# EAGLE design RobotnikCytronController (EAGLE 6.6.0)
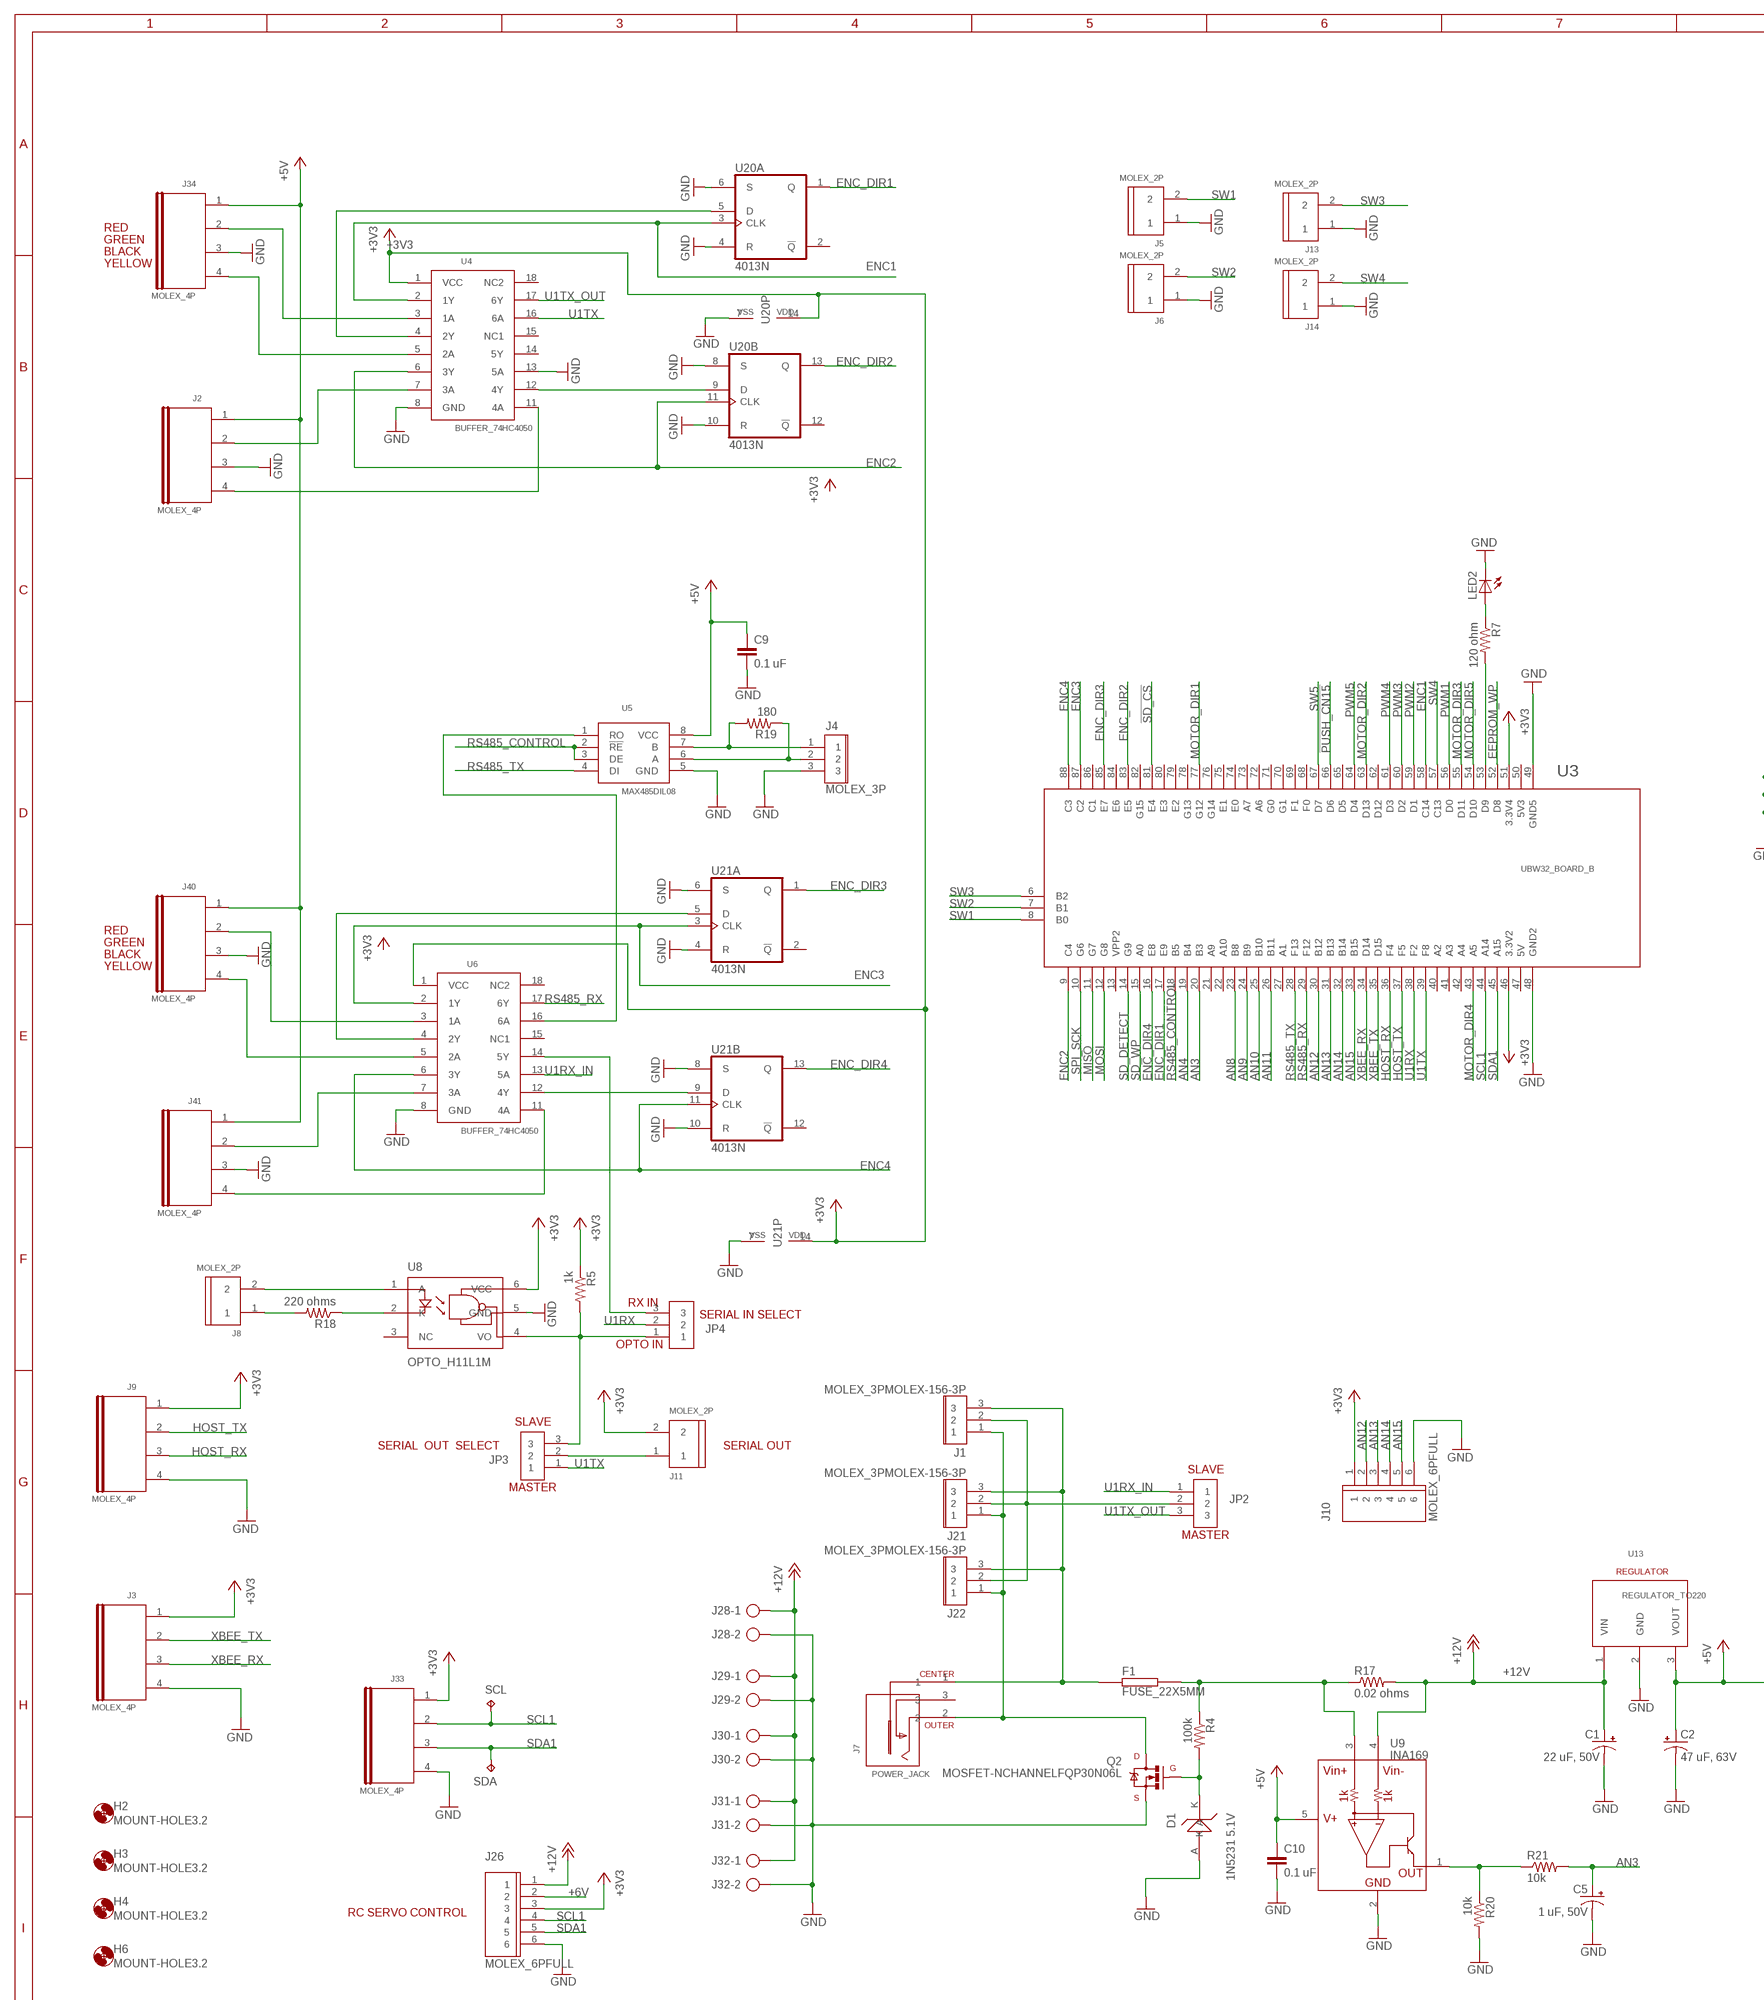
[diagram p0: schematic, sheet 1, part 1 of 2]
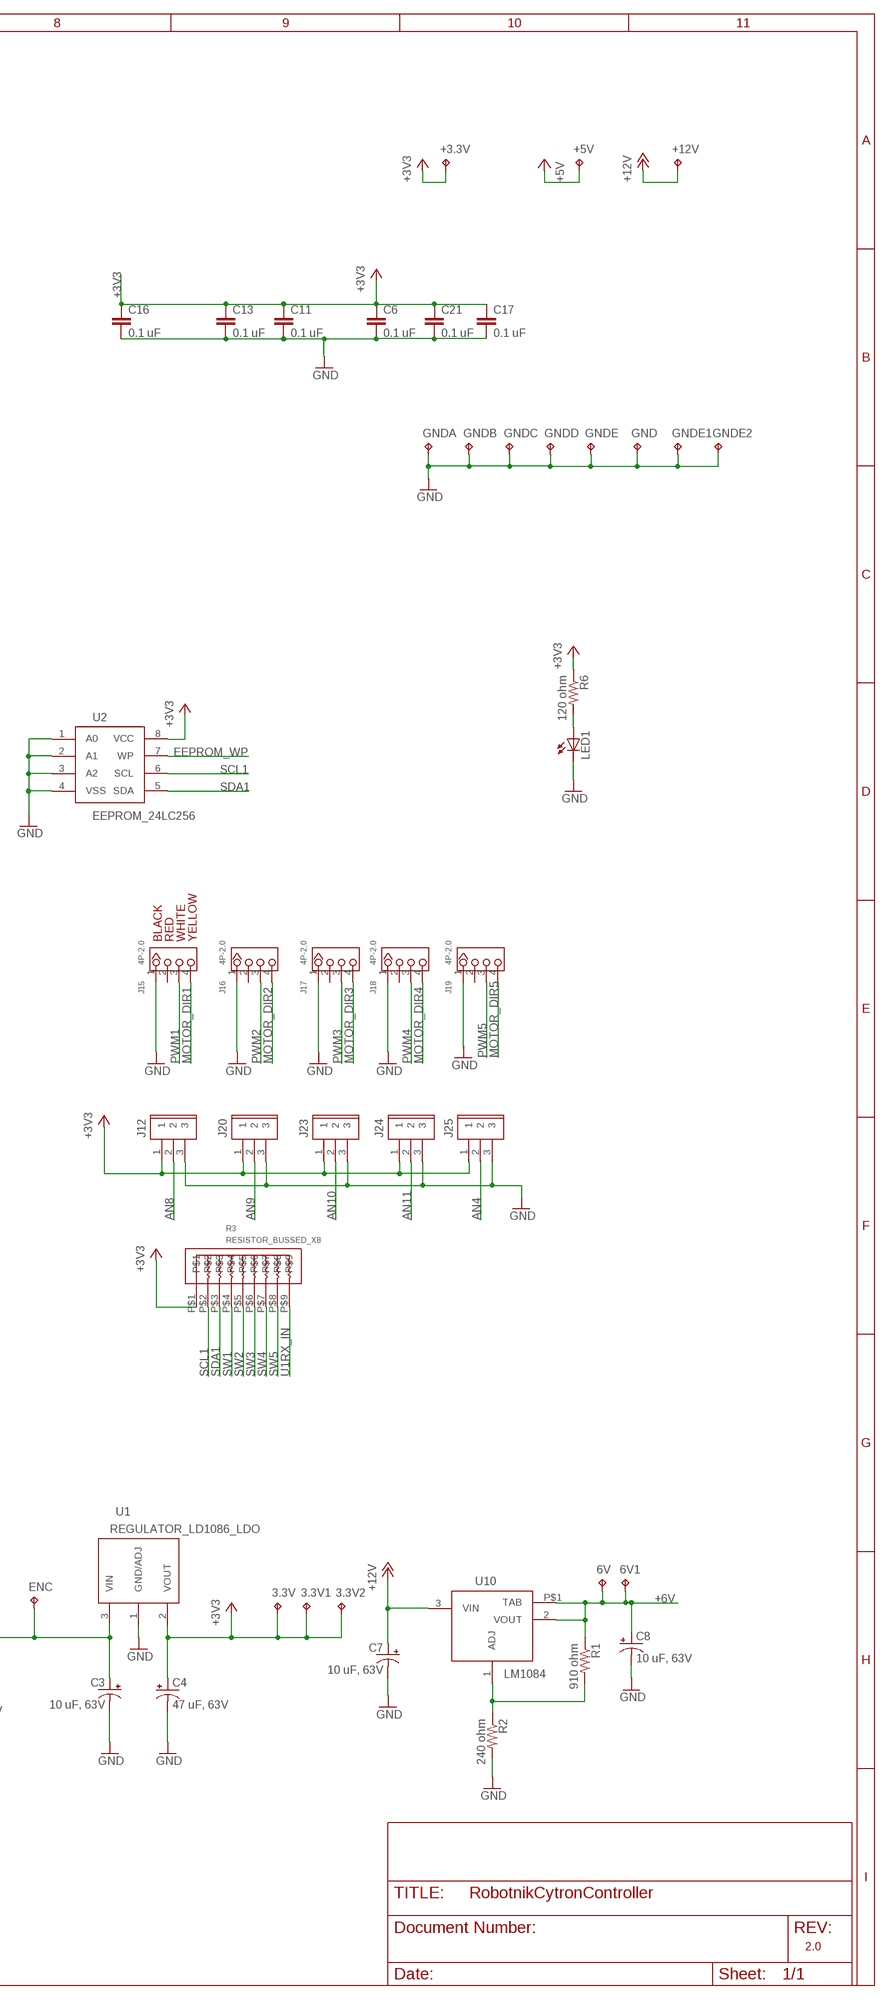
[diagram p1: schematic, sheet 1, part 2 of 2]

## Parts
3.3V  TPPAD1-13  [P1-13]
3.3V1  TPPAD1-13  [P1-13]
3.3V2  TPPAD1-13  [P1-13]
6V  TPPAD1-13  [P1-13]
6V1  TPPAD1-13  [P1-13]
+3.3V  TPPAD1-13  [P1-13]
+5V  TPPAD1-13  [P1-13]
+12V  TPPAD1-13  [P1-13]
C1  22 uF, 50V  POLCAPE2-5  [POLCAP_2MM]
C2  47 uF, 63V  POLCAPE2-5  [POLCAP_2MM]
C3  10 uF, 63V  POLCAPE2-5  [POLCAP_2MM]
C4  47 uF, 63V  POLCAPE2-5  [POLCAP_2MM]
C5  1 uF, 50V  POLCAPE2-5  [POLCAP_2MM]
C6  0.1 uF  C5/2.5  [C5B2.5]
C7  10 uF, 63V  POLCAPE2-5  [POLCAP_2MM]
C8  10 uF, 63V  POLCAPE2-5  [POLCAP_2MM]
C9  0.1 uF  C5/2.5  [C5B2.5]
C10  0.1 uF  C5/2.5  [C5B2.5]
C11  0.1 uF  C5/2.5  [C5B2.5]
C13  0.1 uF  C5/2.5  [C5B2.5]
C16  0.1 uF  C5/2.5  [C5B2.5]
C17  0.1 uF  C5/2.5  [C5B2.5]
C21  0.1 uF  C5/2.5  [C5B2.5]
D1  1N5231 5.1V  DIODE-ZENER  [T-18_THRU]
ENC  TPPAD1-13  [P1-13]
F1  FUSE_22X5MM  [SH22,5]
GND  TPPAD1-13  [P1-13]
GNDA  TPPAD1-13  [P1-13]
GNDB  TPPAD1-13  [P1-13]
GNDC  TPPAD1-13  [P1-13]
GNDD  TPPAD1-13  [P1-13]
GNDE  TPPAD1-13  [P1-13]
GNDE1  TPPAD1-13  [P1-13]
GNDE2  TPPAD1-13  [P1-13]
H2  MOUNT-HOLE3.2  [3,2]
H3  MOUNT-HOLE3.2  [3,2]
H4  MOUNT-HOLE3.2  [3,2]
H6  MOUNT-HOLE3.2  [3,2]
J1  MOLEX_3PMOLEX-156-3P  [MOLEX-156-3]
J2  MOLEX_4P  [MOLEX_4P_SLIM]
J3  MOLEX_4P  [MOLEX_4P_SLIM]
J4  MOLEX_3P  [MOLEX_3P]
J5  MOLEX_2P  [MOLEX_2P]
J6  MOLEX_2P  [MOLEX_2P]
J7  POWER_JACK  [POWER_JACK_PJ-202A]
J8  MOLEX_2P  [MOLEX_2P]
J9  MOLEX_4P  [MOLEX_4P_SLIM]
J10  MOLEX_6PFULL  [MOLEX_6P]
J11  MOLEX_2P  [MOLEX_2P]
J12  MOLEX_3P  [MOLEX_3P]
J13  MOLEX_2P  [MOLEX_2P]
J14  MOLEX_2P  [MOLEX_2P]
J15  4P-2.0  GROVE-CONNECTOR-DIP(4P-2.0)  [HW4-2.0]
J16  4P-2.0  GROVE-CONNECTOR-DIP(4P-2.0)  [HW4-2.0]
J17  4P-2.0  GROVE-CONNECTOR-DIP(4P-2.0)  [HW4-2.0]
J18  4P-2.0  GROVE-CONNECTOR-DIP(4P-2.0)  [HW4-2.0]
J19  4P-2.0  GROVE-CONNECTOR-DIP(4P-2.0)  [HW4-2.0]
J20  MOLEX_3P  [MOLEX_3P]
J21  MOLEX_3PMOLEX-156-3P  [MOLEX-156-3]
J22  MOLEX_3PMOLEX-156-3P  [MOLEX-156-3]
J23  MOLEX_3P  [MOLEX_3P]
J24  MOLEX_3P  [MOLEX_3P]
J25  MOLEX_3P  [MOLEX_3P]
J26  MOLEX_6PFULL  [MOLEX_6P]
J28  TRMBLOCK_5MM_2P  [TRMBLOCK_5MM_2P]
J29  TRMBLOCK_5MM_2P  [TRMBLOCK_5MM_2P]
J30  TRMBLOCK_5MM_2P  [TRMBLOCK_5MM_2P]
J31  TRMBLOCK_5MM_2P  [TRMBLOCK_5MM_2P]
J32  TRMBLOCK_5MM_2P  [TRMBLOCK_5MM_2P]
J33  MOLEX_4P  [MOLEX_4P_SLIM]
J34  MOLEX_4P  [MOLEX_4P_SLIM]
J40  MOLEX_4P  [MOLEX_4P_SLIM]
J41  MOLEX_4P  [MOLEX_4P_SLIM]
JP2  JUMPER_3P  [JUMPER_3P_MINI]
JP3  JUMPER_3P  [JUMPER_3P_MINI]
JP4  JUMPER_3P  [JUMPER_3P_MINI]
LED1  LED5MM  [LED5MM]
LED2  LED5MM  [LED5MM]
Q2  MOSFET-NCHANNELFQP30N06L  [TO220V]
R1  910 ohm  RESISTOR0207/12  [1/4_WATT]
R2  240 ohm  RESISTOR0207/12  [1/4_WATT]
R3  RESISTOR_BUSSED_X8  [RESISTOR_BUSSED]
R4  100k  RESISTOR0207/12  [1/4_WATT]
R5  1k  RESISTOR0207/12  [1/4_WATT]
R6  120 ohm  RESISTOR0207/12  [1/4_WATT]
R7  120 ohm  RESISTOR0207/12  [1/4_WATT]
R17  0.02 ohms  RESISTOR_CURRENT_SENSE0309/12  [CURRENT_SENSE]
R18  220 ohms  RESISTOR0207/12  [1/4_WATT]
R19  180  RESISTOR0207/12  [1/4_WATT]
R20  10k  RESISTOR0207/12  [1/4_WATT]
R21  10k  RESISTOR0207/12  [1/4_WATT]
SCL  TPPAD1-13  [P1-13]
SDA  TPPAD1-13  [P1-13]
U1  REGULATOR_LD1086_LDO  [D2PAK]
U2  EEPROM_24LC256  [DIL08]
U3  UBW32_BOARD_B  [UBW32_B]
U4  BUFFER_74HC4050  [DIL18]
U5  MAX485DIL08  [DIL08]
U6  BUFFER_74HC4050  [DIL18]
U8  OPTO_H11L1M  [DIP_6P]
U9  INA169  [SOT23-5]
U10  LM1084  [TO220_HEATSINK]
U13  REGULATOR_TO220  [TO220V]
U20  4013N  [DIL14]
U21  4013N  [DIL14]

## Nets
!PUSH_CN15: U3.66(D6)
!SD_CS: U3.81(E4)
+3V3: 3.3V1.TP 3.3V2.TP 3.3V.TP +3.3V.TP C4.+ C6.1 C11.1 C13.1 C16.1 C17.1 C21.1 J3.1 J9.1 J10.1 J11.2 J12.1 J20.1 J23.1 J24.1 J25.1 J26.3 J33.1 R3.P$1 R5.1 R6.1 U1.2(VOUT) U2.8(VCC) U3.46(3.3V2) U3.51(3.3V4) U4.1(VCC) U6.1(VCC) U8.6(VCC) U20.14(P:VDD) U21.14(P:VDD)
+5V: +5V.TP C2.+ C3.+ C9.1 C10.1 ENC.TP J2.1 J34.1 J40.1 J41.1 U1.3(VIN) U5.8(VCC) U9.5(V+) U13.3(VOUT)
+6V: 6V1.TP 6V.TP C8.+ J26.2 R1.1 U10.2(VOUT) U10.P$1(TAB)
+12V: +12V.TP C1.+ C7.+ J26.1 J28.1 J29.1 J30.1 J31.1 J32.1 R17.2 U9.4(VIN-) U10.3(VIN) U13.1(VIN)
AN3: C5.+ R21.2 U3.20(B3)
AN4: J25.2 U3.19(B4)
AN8: J12.2 U3.23(B8)
AN9: J20.2 U3.24(B9)
AN10: J23.2 U3.25(B10)
AN11: J24.2 U3.26(B11)
AN12: J10.2 U3.30(B12)
AN13: J10.3 U3.31(B13)
AN14: J10.4 U3.32(B14)
AN15: J10.5 U3.33(B15)
EEPROM_WP: U2.7(WP) U3.52(D8)
ENC1: U3.58(C14) U4.2(1Y) U20.3(A:CLK)
ENC2: U3.9(C4) U4.6(3Y) U20.11(B:CLK)
ENC3: U3.87(C2) U6.2(1Y) U21.3(A:CLK)
ENC4: U3.88(C3) U6.6(3Y) U21.11(B:CLK)
ENC_DIR1: U3.17(E9) U20.1(A:Q)
ENC_DIR2: U3.83(E5) U20.13(B:Q)
ENC_DIR3: U3.85(E7) U21.1(A:Q)
ENC_DIR4: U3.16(E8) U21.13(B:Q)
GND: C1.- C2.- C3.- C4.- C5.- C6.2 C7.- C8.- C9.2 C10.2 C11.2 C13.2 C16.2 C17.2 C21.2 D1.A GND.TP GNDA.TP GNDB.TP GNDC.TP GNDD.TP GNDE1.TP GNDE2.TP GNDE.TP J2.3 J3.4 J4.3 J5.1 J6.1 J9.4 J10.6 J12.3 J13.1 J14.1 J15.1 J16.1 J17.1 J18.1 J19.1 J20.3 J23.3 J24.3 J25.3 J26.6 J28.2 J29.2 J30.2 J31.2 J32.2 J33.4 J34.3 J40.3 J41.3 LED1.K(C) LED2.K(C) Q2.3(S) R2.2 R20.2 U1.1(GND/ADJ) U2.1(A0) U2.2(A1) U2.3(A2) U2.4(VSS) U3.48(GND2) U3.49(GND5) U4.8(GND) U4.13(5A) U5.5(GND) U6.8(GND) U8.5(GND) U9.2(GND) U13.2(GND) U20.4(A:R) U20.6(A:S) U20.7(P:VSS) U20.8(B:S) U20.10(B:R) U21.4(A:R) U21.6(A:S) U21.7(P:VSS) U21.8(B:S) U21.10(B:R)
HOST_RX: J9.3 U3.36(F4)
HOST_TX: J9.2 U3.37(F5)
MISO: U3.11(G7)
MOSI: U3.12(G8)
MOTOR_DIR1: J15.4 U3.77(G12)
MOTOR_DIR2: J16.4 U3.63(D13)
MOTOR_DIR3: J17.4 U3.55(D11)
MOTOR_DIR4: J18.4 U3.43(A5)
MOTOR_DIR5: J19.4 U3.54(D10)
N$1: D1.K Q2.1(G) R4.2
N$2: U4.12(4Y) U20.9(B:D)
N$3: LED1.A R6.2
N$4: J1.1 J7.2 J21.1 J22.1 Q2.2(D)
N$5: J11.1 JP3.2
N$6: JP4.3 U6.14(5Y)
N$7: J34.2 U4.3(1A)
N$8: U5.1(RO) U6.16(6A)
N$9: F1.1 J1.3 J7.1 J21.3 J22.3
N$10: U4.4(2Y) U20.5(A:D)
N$11: J34.4 U4.5(2A)
N$12: R7.2 U3.53(D9)
N$13: LED2.A R7.1
N$15: J2.2 U4.7(3A)
N$16: J2.4 U4.11(4A)
N$17: R1.2 R2.1 U10.1(ADJ)
N$19: J4.1 R19.2 U5.7(B)
N$20: J4.2 R19.1 U5.6(A)
N$22: J40.2 U6.3(1A)
N$23: J8.1 R18.2
N$24: U6.4(2Y) U21.5(A:D)
N$25: J40.4 U6.5(2A)
N$26: U6.12(4Y) U21.9(B:D)
N$27: R18.1 U8.2(K)
N$28: J41.2 U6.7(3A)
N$29: J41.4 U6.11(4A)
N$30: J1.2 J21.2 J22.2 JP2.2
N$32: J8.2 U8.1(A)
N$33: F1.2 R4.1 R17.1 U9.3(VIN+)
N$36: R20.1 R21.1 U9.1(OUT)
OPTO_IN: JP3.3 JP4.1 R5.2 U8.4(VO)
PWM1: J15.3 U3.56(D0)
PWM2: J16.3 U3.59(D1)
PWM3: J17.3 U3.60(D2)
PWM4: J18.3 U3.61(D3)
PWM5: J19.3 U3.64(D4)
RS485_CONTROL: U3.18(B5) U5.2(!RE) U5.3(DE)
RS485_RX: U3.29(F12)
RS485_TX: U3.28(F13) U5.4(DI)
SCL1: J26.4 J33.2 R3.P$2 SCL.TP U2.6(SCL) U3.44(A14)
SD_DETECT: U3.14(G9)
SD_WP: U3.15(A0)
SDA1: J26.5 J33.3 R3.P$3 SDA.TP U2.5(SDA) U3.45(A15)
SPI_SCK: U3.10(G6)
SW1: J5.2 R3.P$4 U3.8(B0)
SW2: J6.2 R3.P$5 U3.7(B1)
SW3: J13.2 R3.P$6 U3.6(B2)
SW4: J14.2 R3.P$7 U3.57(C13)
SW5: R3.P$8 U3.67(D7)
U1RX: JP4.2 U3.38(F2)
U1RX_IN: JP2.1 R3.P$9 U6.13(5A)
U1TX: JP3.1 U3.39(F8)
U1TX_OUT: JP2.3
XBEE_RX: J3.3 U3.34(D14)
XBEE_TX: J3.2 U3.35(D15)
Unconnected: J7.3 J15.2 J16.2 J17.2 J18.2 J19.2 U3.13(VPP2) U3.21(A9) U3.22(A10) U3.27(A1) U3.40(A2) U3.41(A3) U3.42(A4) U3.62(D12) U3.65(D5) U3.68(F0) U3.69(F1) U3.70(G1) U3.71(G0) U3.72(A6) U3.73(A7) U3.74(E0) U3.75(E1) U3.76(G14) U3.78(G13) U3.79(E2) U3.80(E3) U3.82(G15) U3.84(E6) U3.86(C1) U4.14(5Y) U4.15(NC1) U4.16(6A) U4.17(6Y) U4.18(NC2) U6.15(NC1) U6.17(6Y) U6.18(NC2) U8.3(NC) U20.2(A:!Q) U20.12(B:!Q) U21.2(A:!Q) U21.12(B:!Q)

## Notes on the sheet
- RED
- GREEN
- BLACK
- YELLOW
- RED
- GREEN
- BLACK
- YELLOW | BLACK | RED | WHITE | YELLOW
- RX IN
- SERIAL IN SELECT
- OPTO IN
- SLAVE
- SERIAL  OUT  SELECT | SERIAL OUT
- SLAVE
- MASTER
- MASTER
- D
- G
- S
- RC SERVO CONTROL
- 2.0

## Power pins joined to a net without a drawn wire
5V: U3.47(5V)
5V3: U3.50(5V3)

## Library data of the parts
3.3V 3.3V1 3.3V2 6V 6V1 +3.3V +5V +12V ENC GND GNDA GNDB GNDC GNDD GNDE GNDE1 GNDE2 SCL SDA = testpad:TP: Test pad
C1-C5 C7 C8 = JimLib:POLCAP: POLARIZED CAPACITOR, American symbol
C6 C9-C11 C13 C16 C17 C21 = capacitor-wima:C: CAPACITOR naming: grid - package width
D1 = JimLib:DIODE-ZENER
F1 = JimLib:FUSE_22X5MM: Through hole 22x5mm fuse holder
H2-H4 H6 = holes:MOUNT-HOLE: MOUNTING HOLE with drill center marker
J1 J4 J12 J20-J25 = JimLib:MOLEX_3P
J2 J3 J9 J33 J34 J40 J41 = JimLib:MOLEX_4P: .100" (2.54mm) Center Header - 3 Pin
J5 J6 J8 J11 J13 J14 = JimLib:MOLEX_2P
J7 = JimLib:POWER_JACK
J10 J26 = JimLib:MOLEX_6P: .100" (2.54mm) Center Header - 3 Pin
J15-J19 = Seeed-Connector -2016:GROVE-CONNECTOR-DIP(4P-2.0): 320110033
J28-J32 = JimLib:TRMBLOCK_5MM_2P: CONNECTOR
JP2-JP4 = JimLib:JUMPER_3P
LED1 LED2 = JimLib:LED: LED OSRAM: - CHIPLED LG R971, LG N971, LY N971, LG Q971, LY Q971, LO R971, LY R971 LH N974, LH R974 LS Q976, LO Q976, LY Q976 LO Q996 - Hyper CHIPLED LW Q18S LB Q993, LB Q99A, LB R99A - SideLED LS A670, LO A670, LY A670, LG A670, LP A670 LB A673, LV A673, LT A673, LW A673 LH A674 LY A675 LS A676, LA A676, LO A676, LY A676, LW A676 LS A679, LY A679, LG A679 - Hyper Micro SIDELED® LS Y876, LA Y876, LO Y876, LY Y876 LT Y87S - SmartLED LW L88C, LW L88S LB L89C, LB L89S, LG L890 LS L89K, LO L89K, LY L89K LS L896, LA L896, LO L896, LY L896 - TOPLED LS T670, LO T670, LY T670, LG T670, LP T670 LSG T670, LSP T670, LSY T670, LOP T670, LYG T670 LG T671, LOG T671, LSG T671 LB T673, LV T673, LT T673, LW T673 LH T674 LS T676, LA T676, LO T676, LY T676, LB T676, LH T676, LSB T676, LW T676 LB T67C, LV T67C, LT T67C, LS T67K, LO T67K, LY T67K, LW E67C LS E67B, LA E67B, LO E67B, LY E67B, LB E67C, LV E67C, LT E67C LW T67C LS T679, LY T679, LG T679 LS T770, LO T770, LY T770, LG T770, LP T770 LB T773, LV T773, LT T773, LW T773 LH T774 LS E675, LA E675, LY E675, LS T675 LS T776, LA T776, LO T776, LY T776, LB T776 LHGB T686 LT T68C, LB T68C - Hyper Mini TOPLED® LB M676 - Mini TOPLED Santana® LG M470 LS M47K, LO M47K, LY M47K Source: http://www.osram.convergy.de LUXEON: - LUMILED® LXK2-PW12-R00, LXK2-PW12-S00, LXK2-PW14-U00, LXK2-PW14-V00 LXK2-PM12-R00, LXK2-PM12-S00, LXK2-PM14-U00 LXK2-PE12-Q00, LXK2-PE12-R00, LXK2-PE12-S00, LXK2-PE14-T00, LXK2-PE14-U00 LXK2-PB12-K00, LXK2-PB12-L00, LXK2-PB12-M00, LXK2-PB14-N00, LXK2-PB14-P00, LXK2-PB14-Q00 LXK2-PR12-L00, LXK2-PR12-M00, LXK2-PR14-Q00, LXK2-PR14-R00 LXK2-PD12-Q00, LXK2-PD12-R00, LXK2-PD12-S00 LXK2-PH12-R00, LXK2-PH12-S00 LXK2-PL12-P00, LXK2-PL12-Q00, LXK2-PL12-R00 Source: www.luxeon.com KINGBRIGHT: KA-3528ASYC Source: www.kingbright.com
Q2 = JimLib:MOSFET-NCHANNEL: Common NMOSFET Parts MFG P/N Store ID Prod ID FDD8780 TRANS-09984 SI7820DN TRANS-11055 FDS6630A IC-08089 2N7002PW TRANS-11151 FQP30N06L COM-10213 TRANS-10060 BSS123LT1G TRANS-08345 BSS138 TRANS-00830 BS170 2N7000; PROD_ID: TRANS-10060
R1 R2 R4-R7 R18-R21 = JimLib:RESISTOR: RESISTOR, American symbol
R3 = JimLib:RESISTOR_BUSSED_X8
R17 = JimLib:RESISTOR_CURRENT_SENSE: RESISTOR, American symbol
U1 = JimLib:REGULATOR_LD1086_LDO
U2 = JimLib:EEPROM_24LC256
U3 = JimLib:UBW32_BOARD_B: UBW32 - 32 bit PIC32 based USB Bit Whacker Version 2.6 Technical Specifications: PIC 32MX795F512L 8.0 Mhz Crystal VCC: 7.6-15V
U4 U6 = JimLib:BUFFER_74HC4050: Non-Inverting Hex Buffer 2V-6V supply
U5 = JimLib:MAX485
U8 = JimLib:OPTO_H11L1M
U9 = JimLib:INA169
U10 = JimLib:LM1084
U13 = JimLib:REGULATOR_TO220
U20 U21 = JimLib:4013: Dual D FLIP FLOP, set/reset

## Board
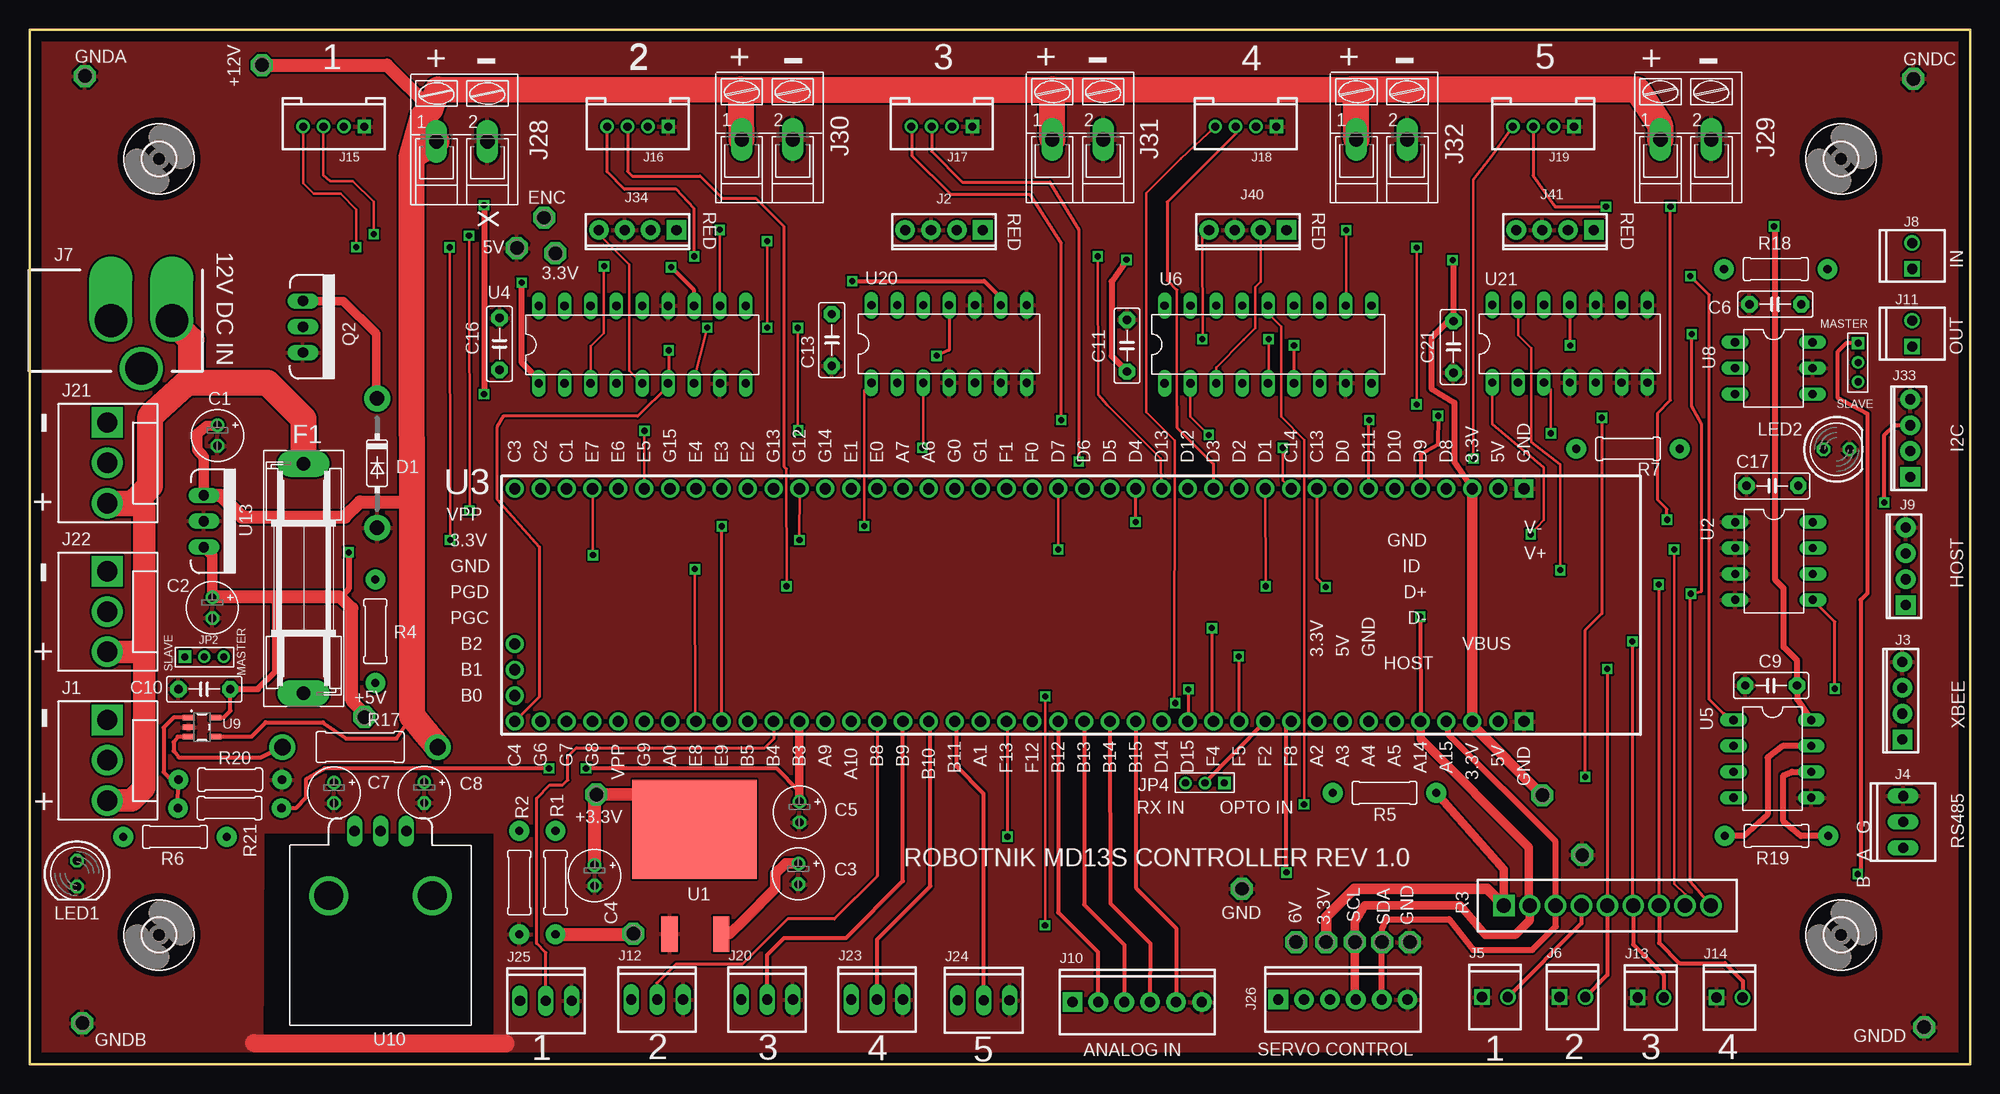
[diagram p2: board, top side]
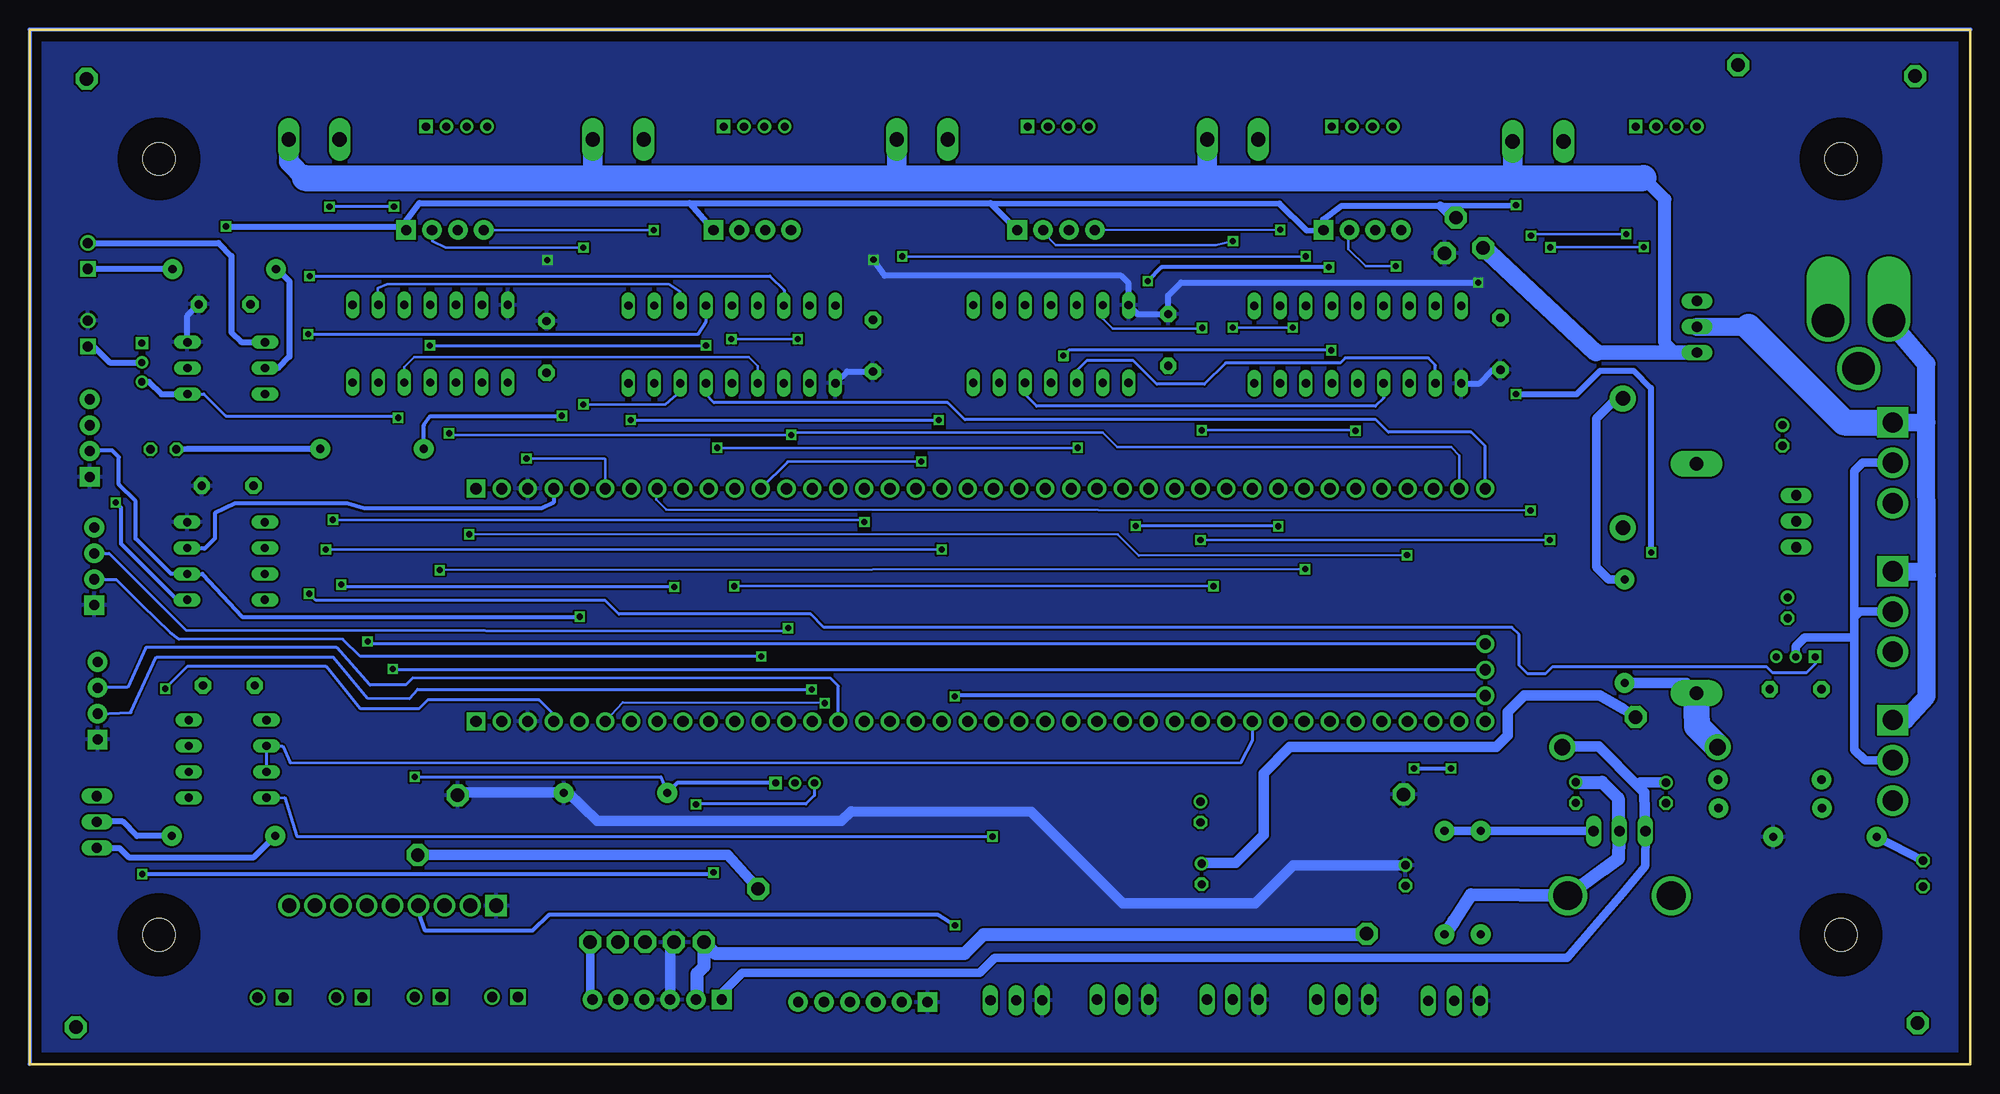
[diagram p3: board, bottom side, seen from below]

Size 190.5 x 101.6 mm. Coordinates in mm from the lower left corner, seen from the top.
Outline: 0,0 190.5,0 190.5,101.6 0,101.6 0,0
Copper layers (1*16): Top 0.035mm / dielectric 1.5mm / Bottom 0.035mm
Design rules "default *": minimum track width 10mil, minimum drill 19mil, track to track 8mil, track to pad 8mil, pad to pad 8mil, via to via 8mil, smd to smd 8mil, copper to edge 40mil, drill to drill 8mil, minimum pad ring 10mil, minimum via ring 8mil, stop-mask expansion 4mil, vias tented up to drill 0mil, thermal gap 10mil

### Footprints (pad centres in the part's own frame; a part is rotated, then mirrored left to right if it is on the bottom)
P1-13 = drill 1.321 pad 2.159 octagon: TP 0,0
POLCAP_2MM = drill 0.813 pad 1.27: + -1.016,0 | drill 0.813 pad 1.27 octagon: - 1.016,0
C5B2.5 = drill 0.813 pad 1.6 octagon: 1 -2.54,0; 2 2.54,0
T-18_THRU = drill 1.4 pad 2.54: A 6.35,0; K -6.35,0
SH22,5 = drill 1.321 pad 2.54 long: 1 -11.252,0; 2 11.252,0
3,2 = hole 3.2: 0,0
MOLEX-156-3 = drill 2 square: 1 -3.96,0 | drill 2: 2 0,0; 3 3.96,0
MOLEX_4P_SLIM = drill 1 pad 1.93 square: 1 -3.81,0 | drill 1 pad 1.93: 2 -1.27,0; 3 1.27,0; 4 3.81,0
MOLEX_3P = drill 1 long: 1 -2.54,0; 2 0,0; 3 2.54,0
MOLEX_2P = drill 1 square: 1 -1.27,0 | drill 1: 2 1.27,0
POWER_JACK_PJ-202A = drill 3.2 offset: 1 0,0; 2 0,6 | drill 3.2: 3 -4.7,3
MOLEX_6P = drill 1 pad 1.93 square: 1 -3.81,0 | drill 1 pad 1.93: 2 -1.27,0; 3 1.27,0; 4 3.81,0; 5 6.35,0; 6 8.89,0
HW4-2.0 = drill 0.8 pad 1.27 square: 1 -3,0 | drill 0.8 pad 1.27: 2 -1,0; 3 1,0; 4 3,0
TRMBLOCK_5MM_2P = drill 1.4 long: 1 -1.854,-1.27; 2 3.15,-1.27
JUMPER_3P_MINI = drill 0.7 square: 1 -1.905,0 | drill 0.7: 2 0,0; 3 1.905,0
LED5MM = drill 0.813 octagon: A -1.27,0; K 1.27,0
TO220V = drill 1.016 long: 1 -2.54,0; 2 0,0; 3 2.54,0
1/4_WATT = drill 0.813 pad 1.93: 1 -5.08,0; 2 5.08,0
RESISTOR_BUSSED = drill 1.4 square: P$1 0,0 | drill 1.4: P$2 2.54,0; P$3 5.08,0; P$4 7.62,0; P$5 10.16,0; P$6 12.7,0; P$7 15.24,0; P$8 17.78,0; P$9 20.32,0
CURRENT_SENSE = drill 1.6 pad 2.54: 1 -7.62,0; 2 7.62,0
D2PAK = smd 1.6 x 3.5: 1 -2.54,-10.275; 3 2.54,-10.275 | smd 12.2 x 9.75: 2 -0.1,0
DIL08 = drill 0.813 long: 1 -3.81,-3.81; 2 -1.27,-3.81; 3 1.27,-3.81; 4 3.81,-3.81; 5 3.81,3.81; 6 1.27,3.81; 7 -1.27,3.81; 8 -3.81,3.81
UBW32_B = drill 1.1 pad 1.778: 6 -49.53,-3.81; 7 -49.53,-6.35; 8 -49.53,-8.89; 9 -49.53,-11.43; 10 -46.99,-11.43; 11 -44.45,-11.43; 12 -41.91,-11.43; 13 -39.37,-11.43; 14 -36.83,-11.43; 15 -34.29,-11.43; 16 -31.75,-11.43; 17 -29.21,-11.43; 18 -26.67,-11.43; 19 -24.13,-11.43; 20 -21.59,-11.43; 21 -19.05,-11.43; 22 -16.51,-11.43; 23 -13.97,-11.43; 24 -11.43,-11.43; 25 -8.89,-11.43; 26 -6.35,-11.43; 27 -3.81,-11.43; 28 -1.27,-11.43; 29 1.27,-11.43; 30 3.81,-11.43; 31 6.35,-11.43; 32 8.89,-11.43; 33 11.43,-11.43; 34 13.97,-11.43; 35 16.51,-11.43; 36 19.05,-11.43; 37 21.59,-11.43; 38 24.13,-11.43; 39 26.67,-11.43; 40 29.21,-11.43; 41 31.75,-11.43; 42 34.29,-11.43; 43 36.83,-11.43; 44 39.37,-11.43; 45 41.91,-11.43; 46 44.45,-11.43; 47 46.99,-11.43; 50 46.99,11.43; 51 44.45,11.43; 52 41.91,11.43; 53 39.37,11.43; 54 36.83,11.43; 55 34.29,11.43; 56 31.75,11.43; 57 29.21,11.43; 58 26.67,11.43; 59 24.13,11.43; 60 21.59,11.43; 61 19.05,11.43; 62 16.51,11.43; 63 13.97,11.43; 64 11.43,11.43; 65 8.89,11.43; 66 6.35,11.43; 67 3.81,11.43; 68 1.27,11.43; 69 -1.27,11.43; 70 -3.81,11.43; 71 -6.35,11.43; 72 -8.89,11.43; 73 -11.43,11.43; 74 -13.97,11.43; 75 -16.51,11.43; 76 -19.05,11.43; 77 -21.59,11.43; 78 -24.13,11.43; 79 -26.67,11.43; 80 -29.21,11.43; 81 -31.75,11.43; 82 -34.29,11.43; 83 -36.83,11.43; 84 -39.37,11.43; 85 -41.91,11.43; 86 -44.45,11.43; 87 -46.99,11.43; 88 -49.53,11.43 | drill 1.1 pad 1.778 square: 48 49.53,-11.43; 49 49.53,11.43
DIL18 = drill 0.813 long: 1 -10.16,-3.81; 2 -7.62,-3.81; 3 -5.08,-3.81; 4 -2.54,-3.81; 5 0,-3.81; 6 2.54,-3.81; 7 5.08,-3.81; 8 7.62,-3.81; 9 10.16,-3.81; 10 10.16,3.81; 11 7.62,3.81; 12 5.08,3.81; 13 2.54,3.81; 14 0,3.81; 15 -2.54,3.81; 16 -5.08,3.81; 17 -7.62,3.81; 18 -10.16,3.81
DIP_6P = drill 0.813 long: 1 -3.81,-3.81; 2 -1.27,-3.81; 3 1.27,-3.81; 4 1.27,3.81; 5 -1.27,3.81; 6 -3.81,3.81
SOT23-5 = smd 0.55 x 1.2: 1 -0.95,-1.3; 2 0,-1.3; 3 0.95,-1.3; 4 0.95,1.3; 5 -0.95,1.3
TO220_HEATSINK = drill 1.016 long: 1 -2.54,0; 2 0,0; 3 2.54,0 | drill 2.8: P$1 -5.08,6.35; P$2 5.08,6.35
DIL14 = drill 0.813 long: 1 -7.62,-3.81; 2 -5.08,-3.81; 3 -2.54,-3.81; 4 0,-3.81; 5 2.54,-3.81; 6 5.08,-3.81; 7 7.62,-3.81; 8 7.62,3.81; 9 5.08,3.81; 10 2.54,3.81; 11 0,3.81; 12 -2.54,3.81; 13 -5.08,3.81; 14 -7.62,3.81

### Placement (x,y rotation side)
3.3V  127.25,11.99 0 top
3.3V1  148.49,26.42 0 top
3.3V2  51.61,79.63 0 top
6V  124.31,11.99 0 top
6V1  59.26,12.83 0 top
+3.3V  55.63,26.49 180 top
+5V  32.87,34.09 0 top
+12V  22.81,98.12 0 top
C1  18.43,61.74 270 top
C2  17.93,44.83 270 top
C3  75.45,18.69 270 top
C4  55.45,18.54 270 top
C5  75.56,24.77 270 top
C6  171.35,74.63 180 top
C7  29.87,26.64 270 top
C8  38.73,26.67 270 top
C9  170.94,37.19 180 top
C10  17.14,36.83 180 top
C11  107.72,70.56 90 top
C13  78.74,71.12 270 top
C16  46.13,70.74 90 top
C17  171.07,56.79 180 top
C21  139.75,70.43 270 top
D1  34.11,59.03 270 top
ENC  50.5,83.13 0 top
F1  26.9,47.7 270 top
GND  135.48,11.99 0 top
GNDA  5.44,97.03 0 top
GNDB  5.18,4.04 0 top
GNDC  184.91,96.77 0 top
GNDD  185.95,3.63 90 top
GNDE  47.83,80.16 0 top
GNDE1  152.4,20.55 0 top
GNDE2  119,17.22 0 top
H2  12.7,12.7 0 top
H3  177.8,12.7 0 top
H4  177.8,88.9 0 top
H6  12.7,88.9 0 top
J1  7.62,29.84 270 top
J2  89.75,81.92 180 top
J3  183.82,35.69 90 top
J4  183.9,23.79 90 top
J5  143.83,6.59 0 top
J6  151.44,6.59 0 top
J7  13.97,73.03 90 top
J8  184.78,79.38 90 top
J9  184.15,48.9 90 top
J10  106.17,6.1 0 top
J11  184.78,71.75 90 top
J12  61.59,6.35 0 top
J13  159.12,6.54 0 top
J14  166.85,6.54 0 top
J15  29.84,92.08 180 top
J16  59.69,92.08 180 top
J17  89.53,92.08 180 top
J18  119.38,92.08 180 top
J19  148.59,92.08 180 top
J20  72.39,6.35 0 top
J21  7.62,59.05 270 top
J22  7.62,44.45 270 top
J23  83.19,6.35 0 top
J24  93.65,6.27 0 top
J25  50.67,6.22 0 top
J26  126.36,6.35 0 top
J28  41.78,91.9 0 top
J29  161.93,92.08 0 top
J30  71.75,92.08 0 top
J31  102.23,92.08 0 top
J32  132.08,92.08 0 top
J33  184.6,61.48 90 top
J34  59.69,81.92 180 top
J40  119.57,81.92 180 top
J41  149.73,81.92 180 top
JP2  17.14,40.01 0 top
JP3  179.48,68.91 270 top
JP4  115.37,27.61 180 top
LED1  4.65,18.72 270 top
LED2  177.37,60.38 0 top
Q2  26.82,72.42 270 top
R1  51.61,17.83 90 top
R2  48.06,17.83 270 top
R3  144.71,15.57 0 top
R4  33.94,42.53 90 top
R5  132.99,26.64 180 top
R6  14.27,22.33 180 top
R7  156.9,60.43 180 top
R17  32.44,31.14 0 top
R18  171.4,78.08 0 top
R19  171.47,22.42 180 top
R20  19.68,27.94 0 top
R21  19.63,25.15 0 top
SCL  130.07,12.01 90 top
SDA  132.77,11.99 270 top
U1  65.36,23.06 0 top
U2  171.22,49.41 270 top
U3  97.16,45.09 0 top
U4  60.13,70.67 0 top
U5  171.07,29.98 270 top
U6  121.56,70.69 0 top
U8  171.2,67.08 270 top
U9  16.92,33.1 270 top
U10  34.44,22.89 180 top
U13  17.1,53.32 270 top
U20  90.25,70.73 0 top
U21  151.18,70.75 0 top

### Tracks (layer width: path | path; a pad name or v marks a point on that pad's centre or on a via)
+3V3  (via drill 0.6)
  Top 0.61: U4.1 49.98,67.22 48.31,68.89 48.31,76.71 48.51,76.73 v48.31,76.76 | v107.67,78.99 107.34,78.49 106.2,76.86 106.2,69.55 C11.1 | 139.27,72.97 137.59,71.3 137.59,66.37 139.85,64.97 139.85,59.13 U3.51 | v139.68,78.97 139.75,78.97 C21.1
  Top 0.813: R3.P$1 144.71,19.12 R5.1
  Top 1.016: U3.51 U3.46 141.6,33.3 3.3V1.TP | 3.3V.TP 127.25,14.45 130.02,17.22 143.06,17.22 R3.P$1
  Top 1.27: U1.2 61.77,26.54 +3.3V.TP 55.45,25.98 C4.+
  Bottom 0.61: v48.31,76.76 77.47,76.76 78.74,75.49 C13.1 81.75,73.66 U20.14 82.63,76.69 83.36,77.42 106.58,77.42 v107.67,78.99 107.64,78.97 | U6.1 110.26,68.02 C11.1 | U4.1 48.21,66.86 46.86,68.2 | U8.6 175.01,73.51 C6.1
  Bottom 0.813: 55.47,19.53 C4.+
  Bottom 1.016: R5.1 137.67,26.67 | 137.67,26.67 148.23,26.67 3.3V1.TP | 55.47,19.53 66.47,19.53 70.21,15.8 83.21,15.8 92.18,24.77 109.86,24.84 110.82,23.88 134.77,23.88 137.67,26.67 | J26.3 127.64,11.61 3.3V.TP
  pour Bottom: 0.03,0.08 22.89,0 35.05,0.08 44.15,0.03 45.69,0.03 190.45,0 190.47,101.5 0.05,101.55
+5V  (via drill 0.6)
  Top 0.406: U9.5 19.06,34.05 19.71,34.7 19.71,36.8 C10.1
  Top 0.61: C10.1 22.4,36.83 24.11,38.53 24.11,45.64 23.88,45.87 | v44.6,84.35 v44.6,65.81 | v31.32,50.27 31.32,46.69 30.5,45.87 | v171.22,82.27 171.35,82.14 171.35,47.55 172.16,46.74 172.16,40.97 173.48,39.65 C9.1 173.48,35.83 U5.8
  Top 1.016: C2.+ 17.93,49.95 U13.3 | U1.3 68.74,12.79 70.13,14.17 70.13,14.2 73.2,17.27 73.2,18.72 74.22,19.74 75.42,19.74 C3.+
  Top 1.27: +5V.TP 32.87,34.44 31.62,35.69 31.62,44.76 30.5,45.87 23.88,45.87 17.97,45.87 C2.+
  Bottom 0.61: 125.72,84.56 152.25,84.56 153.54,82.86 J41.1 153.9,82.27 v171.22,82.27 | 125.72,84.56 96.19,84.56 | 96.19,84.56 67.82,84.53 65.15,81.86 63.52,81.89 | 63.52,81.89 J34.1 | 96.19,84.56 96.19,84.55 J2.1 | 125.72,84.56 J40.1 | 63.52,81.89 63.52,82.96 61.72,84.3 52.05,84.3 v44.6,84.35 | v44.6,65.81 38.66,65.79 36.35,68.1 33.05,68.1 31.37,66.42 31.37,50.32 v31.32,50.27
  Bottom 0.813: ENC.TP 50.88,83.13 52.05,84.3
  Bottom 1.016: +5V.TP 34.09,34.9 36.37,36.2 43.79,36.2 45.39,34.59 45.39,32.31 46.56,31.14 66.8,31.14 69.37,28.57 69.37,22.53 72.11,19.79 75.37,19.79 C3.+
+6V
  Top 1.27: R1.1 59.18,12.75 6V1.TP
  Bottom 1.27: R1.1 50.72,14.05 49.02,16.64 U10.P$1 35.92,19.18 34.52,20.19 34.44,22.05 U10.2 34.57,22.15 34.57,26.11 36.14,27.69 C8.+ | J26.2 124.99,6.45 124.99,8.89 124.31,9.58 6V.TP 123.17,10.85 98.75,10.85 96.85,12.75 59.33,12.75 6V1.TP
+12V
  Top 0.406: 37.54,34.19 36.02,31.98 31.06,31.98 28.78,33.58 23.16,33.58 21.73,32.15 U9.4
  Top 1.016: 37.55,55.84 37.41,56.06 | U13.1 17.1,59.63 16.43,60.35 16.43,61.95 17.37,62.69 18.21,62.74 C1.+
  Top 1.27: 37.54,34.19 37.47,55.71 37.55,55.84 37.85,55.22 32.44,55.22 30.94,53.72 20.85,53.72 18.71,55.86 U13.1 | +12V.TP 35.08,98.12 39.37,93.83
  Top 2.54: 37.49,89.1 37.54,34.19 38.94,32.49 R17.2 | 37.49,89.1 J28.1 | 37.49,89.1 38.63,93.09 39.37,93.83 40.11,95.73 69.8,95.71 | 69.8,95.71 100.38,95.71 | 100.38,95.71 129.72,95.73 | 129.72,95.73 157.76,95.73 160.04,92.2 160.04,90.83 J29.1 | J32.1 130.23,94.41 129.72,95.73 | J31.1 100.38,95.71 | J30.1 69.8,95.71
  Bottom 0.813: J26.1 122.56,6.99 120.57,8.97 97.26,8.97 95.78,10.44 39.55,10.44 33.88,17.07 31.98,19.38 31.9,19.58 31.88,22.86 U10.3
  Bottom 1.016: U10.3 32,26.7 32.65,27.34 | 32.65,27.34 36.5,31.19 39.85,31.19 R17.2 | C7.+ 32.33,27.66 32.65,27.34
AN3  (via drill 0.6)
  Top 0.406: C5.+ 75.56,26.8 73.33,29.06 v54.61,29.06 | v50.98,29.06 28.96,29.06 27.13,27.96 27.13,26.16 26.11,25.15 R21.2
  Top 0.813: C5.+ U3.20
  Bottom 0.406: v54.61,29.06 v50.98,29.06
AN4
  Top 0.305: J25.2 50.67,10.95 49.76,11.86 49.76,26.11 51.05,27.41 52.32,27.41 52.83,27.91 52.83,30.23 53.67,31.06 72.16,31.06 73.08,31.98 73.08,33.6 U3.19
AN8
  Top 0.305: U3.23 83.19,18.47 78.99,14.28 74.4,14.28 69.95,9.83 63.42,9.83 61.54,7.95 61.54,6.4 J12.2
AN9
  Top 0.406: J20.2 72.39,10.72 74.07,12.39 80.14,12.39 85.72,17.98 U3.24
AN10
  Top 0.406: J23.2 83.19,12.24 88.42,17.48 88.42,33.5 U3.25
AN11
  Top 0.406: J24.2 93.65,26.57 90.98,29.23 90.98,33.48 U3.26
AN12
  Top 0.406: U3.30 100.97,14.91 104.85,11.02 104.85,6.15 J10.2
AN13
  Top 0.406: U3.31 103.5,15.67 107.47,11.71 107.47,6.12 J10.3
AN14
  Top 0.406: U3.32 106.1,15.77 110.01,11.86 109.96,6.12 J10.4
AN15
  Top 0.406: U3.33 108.58,17.32 112.55,13.36 112.55,6.78 113.08,6.25 112.67,6.25 J10.5
EEPROM_WP
  Bottom 0.406: U3.52 139.06,55.17 140.26,54.59 157.63,54.59 159.33,55.07 170.36,55.07 172.31,54.13 172.31,51.64 173.33,50.62 174.97,50.62 U2.7
ENC1  (via drill 0.6)
  Top 0.254: U20.3 87.71,60.61 v87.63,60.53 | v123.01,60.53 123.01,57.33 U3.58
  Bottom 0.254: v87.63,60.53 v123.01,60.53
  Bottom 0.305: U4.2 52.52,68.64 53.21,69.34 61.37,69.34 61.85,68.86 73.1,68.86 75.18,66.78 79.86,66.78 82.19,69.11 86.72,69.11 87.66,68.17 87.66,66.97 U20.3
ENC2  (via drill 0.6)
  Top 0.305: U3.9 50.04,36.07 50.04,50.8 45.87,55.52 45.87,62.56 46.48,63.63 59.69,63.63 62.67,66.61 U4.6 62.74,66.92 v62.74,70.1 | U20.11 90.25,70.13 v89.03,69.57
  Bottom 0.305: v62.74,70.1 88.49,70.1 v89.03,69.57
ENC3  (via drill 0.6)
  Top 0.254: U6.2 113.94,63.6 v115.75,61.8 | v149.33,61.95 149.33,66.25 U21.3
  Bottom 0.254: v149.33,61.95 149.17,61.8 v115.75,61.8 115.52,62.03 85.14,62.03 83.72,60.6 50.98,60.6 50.16,59.79 U3.87
ENC4  (via drill 0.6)
  Top 0.305: U21.11 151.18,71.05 v151.21,70.59 | v124.1,70.59 U6.6
  Bottom 0.305: v151.21,70.59 v124.1,70.59 | U3.88 47.62,60.71 49,62.08 57.12,62.08 58.34,63.3 98.7,63.3 100.38,64.97 123.34,64.97 124.16,65.79 124.16,66.83 U6.6
ENC_DIR1  (via drill 0.6)
  Top 0.254: v81.92,52.86 81.92,66.13 U20.1
  Top 0.305: U3.17 v67.94,52.83
  Bottom 0.305: v67.94,52.83 81.86,52.83 v81.92,52.86
ENC_DIR2  (via drill 0.6)
  Top 0.254: v75.41,72.31 75.41,62.28 v75.44,62.26 | v60.35,62.2 60.35,56.54 U3.83
  Bottom 0.254: U20.13 85.17,73.21 84.2,72.24 75.49,72.24 v75.41,72.31 | v75.44,62.26 60.4,62.26 v60.35,62.2
ENC_DIR3  (via drill 0.6)
  Top 0.254: U21.1 143.56,62.84 148.62,58.57 148.62,53.44 v147.34,52.05 | v55.3,49.99 55.3,56.46 U3.85
  Bottom 0.254: v147.34,52.05 83.69,52.02 81.64,49.96 v55.3,49.99
ENC_DIR4  (via drill 0.6)
  Top 0.254: U21.13 146.1,71.6 147.4,70.31 147.4,61.11 150.27,58.9 150.24,48.92 v150.24,48.51 | v65.3,48.62 65.35,33.71 U3.16
  Bottom 0.254: v150.24,48.51 v65.3,48.62
GND
  Top 1.778: 22.02,2.06 46.71,2.03
  Bottom 0.813: GND.TP 135.48,6.58 J26.6
  Bottom 1.016: GNDE.TP 47.3,79.73 | 26.85,69.9 Q2.3 | GNDE1.TP 121.97,20.57 GNDE2.TP
  Bottom 1.27: Q2.3 26.87,69.93 29.11,69.93 30,70.81 30,84.94 32.08,87.02
  Bottom 1.422: 36.75,69.9 26.85,69.9
  Bottom 1.778: 47.3,79.73 36.75,69.9
  Bottom 1.93: J28.2 44.93,87.12 44.83,87.02 | J30.2 74.91,87.12 75.01,87.02 | J31.2 105.39,87.25 105.16,87.02 | J32.2 135.23,87.4 135.61,87.02 | J29.2 165.07,88.62 163.47,87.02
  Bottom 2.54: 163.47,87.02 135.61,87.02 105.16,87.02 75.01,87.02 44.83,87.02 32.08,87.02
  pour Top: 0.03,0.08 22.81,0 22.86,22.86 45.72,22.86 45.72,0.05 190.47,0.1 190.55,101.55 0.08,101.57
HOST_RX  (via drill 0.6)
  Top 0.305: v116.05,42.82 116.05,33.81 U3.36
  Bottom 0.305: J9.3 182.7,50.16 175.16,42.62 116.33,42.55 v116.05,42.82
HOST_TX  (via drill 0.6)
  Top 0.305: U3.37 118.75,39.98 v118.69,40.03
  Bottom 0.305: v118.69,40.03 158.04,40.06 159.74,41.73 175.84,41.76 176.68,42.39 179.45,45.06 181.94,47.55 184.07,47.55 J9.2
MOTOR_DIR1  (via drill 0.6)
  Top 0.254: J15.4 26.84,86.52 27.89,85.47 30.53,85.47 32.08,83.92 32.08,80.77 v32.05,80.24 | v41.22,80.21 v41.27,51.49 | v75.56,51.49 75.59,56.49 U3.77
  Bottom 0.254: v32.05,80.24 40.66,80.21 v41.22,80.21 | v41.27,51.49 v75.56,51.49
MOTOR_DIR2  (via drill 0.6)
  Top 0.254: 65.23,79.38 v65.23,79.32 | v104.85,79.32 104.88,65.76 105.77,64.75 111.05,59.49 111.07,56.57 U3.63
  Top 0.305: 65.23,79.38 65.23,84.02 63.48,85.93 58.39,85.93 56.69,87.63 J16.4
  Bottom 0.254: v65.23,79.32 v104.85,79.32
MOTOR_DIR3  (via drill 0.6)
  Top 0.305: U3.55 131.44,63.2 v131.5,63.25 | v101.27,63.25 101.27,80.64 98.22,85.37 90.45,85.37 86.64,89.18 86.64,91.97 J17.4
  Bottom 0.305: v131.5,63.25 v101.27,63.25
MOTOR_DIR4  (via drill 0.6)
  Top 0.254: J18.4 113,88.9 109.63,85.52 109.6,64.06 112.39,61.27 112.37,35.69 v112.45,35.46
  Bottom 0.254: v112.45,35.46 132.26,35.51 U3.43
MOTOR_DIR5  (via drill 0.6)
  Top 0.254: J19.4 143.61,89.31 141.71,86.87 141.71,59.51 v141.73,59.49
  Bottom 0.254: v141.73,59.49 134.09,59.49 134.01,59.41 134.01,56.54 U3.54
N$1
  Top 0.813: Q2.1 30.81,74.95 34.01,71.75 34.01,65.48 D1.K
  Bottom 0.813: R4.2 35.49,47.61 36.7,48.82 36.7,63.4 34.75,65.35 34.13,65.35 D1.K
N$2  (via drill 0.6)
  Top 0.406: U4.12 65.22,76.01 v62.97,78.26 | v80.75,76.91 93.7,76.91 95.2,75.41 95.2,74.67 U20.9
  Bottom 0.406: v62.97,78.26 79.4,78.26 v80.75,76.91
N$3
  Bottom 0.813: R6.2 LED1.A
N$4
  Bottom 1.778: Q2.2 21.79,72.42 | J1.1 6.38,33.8 4.29,36.12 4.27,48.03 | 4.27,48.03 4.32,63.04 | 4.32,63.04 4.32,68.76 J7.2 | J21.1 4.55,63.04 4.32,63.04 | J22.1 4.62,48.38 4.27,48.03
  Bottom 2.54: 21.79,72.42 12.39,63.02 J21.1
N$5
  Bottom 0.61: J11.1 184.23,70.48 182.65,68.91 JP3.2
N$6  (via drill 0.6)
  Top 0.254: U6.14 121.56,73.71 122.83,72.44 122.83,63.6 125.09,61.32 v125.09,25.53
  Bottom 0.305: JP4.3 113.46,26.39 114.3,25.55 125.07,25.55 v125.09,25.53
N$7  (via drill 0.6)
  Top 0.254: U4.3 55.05,70.5 56.34,71.78 56.34,78.31 v56.39,78.36
  Bottom 0.254: v56.39,78.36 59.36,78.36 61.06,80.06 61.06,81.81 J34.2
N$8  (via drill 0.6)
  Top 0.305: U5.1 166.25,34.43 164.87,35.81 164.87,75.54 v163.02,77.39
  Bottom 0.305: v163.02,77.39 117.83,77.39 116.43,76 116.43,74.55 U6.16
N$9
  Top 2.184: J1.3 10.01,25.89 11.25,27.13 11.25,40.23 | 11.25,40.23 11.25,54.67 10.5,55.42 | J22.3 11,40.49 11.25,40.23
  Top 2.54: J21.3 10.16,55.07 10.5,55.42 11.84,56.82 11.86,63.63 15.73,67.17 | 15.73,67.17 15.88,67.31 15.88,71.12 J7.1 | F1.1 26.9,63.37 23.37,66.9 16,66.9 15.73,67.17
N$10
  Bottom 0.305: U4.4 57.59,65.42 58.4,64.62 91.64,64.62 92.76,65.73 92.76,66.89 U20.5
N$11
  Top 0.254: J34.4 55.88,81.53 58.88,78.54 58.88,68.11 U4.5
N$12  (via drill 0.6)
  Top 0.406: v138.25,63.68 138.23,60.83 136.53,59.92 U3.53
  Bottom 0.406: R7.2 151.79,62.76 151.16,63.63 138.23,63.63 v138.25,63.68
N$13
  Bottom 0.61: R7.1 175.01,60.43 LED2.A
N$14
  Bottom 0.406: 0,101.6 190.5,101.6 190.5,0
N$15  (via drill 0.6)
  Top 0.254: v72.39,80.82 v72.42,72.34 | v66.52,72.34 65.15,66.92 U4.7
  Bottom 0.254: J2.2 91.02,81.7 89.76,80.42 74.09,80.42 v72.39,80.82 | v72.42,72.34 v66.52,72.34
N$16  (via drill 0.6)
  Top 0.254: v67.74,81.94 U4.11
  Bottom 0.254: J2.4 v67.74,81.94
N$17
  Bottom 0.813: R1.2 R2.1 37.08,22.91 U10.1
N$19
  Top 0.61: U5.7 172.07,31.25 170.59,30.12 170.59,24.51 168.28,22.43 166.79,22.43 R19.2
  Bottom 0.61: J4.1 181.7,21.25 180.77,20.32 168.49,20.32 R19.2
N$20
  Top 0.61: R19.1 173.87,22.42 172.14,23.85 172.14,28.35 172.97,28.73 174.64,28.73 U5.6
  Bottom 0.61: R19.1 179.98,22.42 181.38,23.82 183.85,23.82 J4.2
N$22
  Top 0.254: J40.2 120.84,76.85 120.29,76.33 120.29,72.29 119.18,71.14 116.48,68.4 116.51,66.9 U6.3
N$23
  Bottom 0.61: J8.1 176.48,78.11 R18.2
N$24
  Bottom 0.254: U21.5 153.72,68.45 152.73,69.42 119.91,69.42 119.05,68.56 119.05,66.9 U6.4
N$25  (via drill 0.6)
  Top 0.254: J40.4 115.73,81.93 115.11,81.31 115.14,71.22 v115.11,71.2 | v121.61,71.2 121.61,66.92 U6.5
  Bottom 0.254: v115.11,71.2 v121.61,71.2
N$26
  Bottom 0.254: U6.12 126.64,75.84 127.76,76.61 155.4,76.61 156.31,76.2 156.31,74.61 U21.9
N$27
  Bottom 0.61: R18.1 166.19,78.08 165,76.89 165,69.47 166.09,68.38 167.36,68.38 U8.2
N$28  (via drill 0.6)
  Top 0.254: v136.14,80.19 v136.14,64.8
  Bottom 0.254: J41.2 151,80.84 149.63,80.19 v136.14,80.19 | v136.14,64.8 128.12,64.77 126.59,66.12 126.59,66.93 U6.7
N$29  (via drill 0.6)
  Top 0.254: v129.24,81.92 129.24,74.55 U6.11
  Bottom 0.254: J41.4 v129.24,81.92
N$30
  Bottom 0.813: J1.2 10.34,29.84 11.38,30.89 11.38,41.76 | 11.38,41.76 11.38,43.94 | 11.38,43.94 11.38,58.27 10.57,59.08 7.64,59.08 J21.2 | J22.2 10.87,44.45 11.38,43.94 | JP2.2 17.14,41.05 16.28,41.91 11.53,41.91 11.38,41.76
N$32
  Bottom 0.61: J8.2 171.96,80.64 170.69,79.38 170.69,71.86 169.75,70.92 167.41,70.92 U8.1
N$33
  Top 0.406: U9.3 14.52,32.15 14.15,31.65 14.15,30.76 14.63,30.15 22.68,30.12 R17.1
  Bottom 1.016: R4.1 27.9,37.45 F1.2
  Bottom 2.54: R17.1 26.82,33.17 F1.2
N$36
  Top 0.406: U9.1 14.13,34.05 13.16,33.07 13.16,28.68 13.89,27.94 R20.1 R21.1
OPTO_IN  (via drill 0.6)
  Top 0.305: v154.33,63.48 154.33,44.25 152.65,42.57 152.65,28.27 v152.71,28.22
  Bottom 0.305: U8.4 173.41,65.81 171.25,63.65 154.51,63.65 v154.33,63.48 | v152.71,28.22 128.55,28.22 R5.2
  Bottom 0.406: JP4.1 126.95,27.61 R5.2
  Bottom 0.61: JP3.3 178.79,67 177.57,65.79 175.03,65.79 U8.4
PWM1  (via drill 0.6)
  Top 0.254: J15.3 28.82,87.31 29.49,86.72 31.7,86.72 33.78,84.68 v33.78,81.51 | v43.13,81.36 v43.18,54.38
  Bottom 0.254: v33.78,81.51 43.43,81.51 v43.13,81.36 | v43.18,54.38 128.02,54.46 129.01,55.45 129.01,56.41 U3.56
PWM2  (via drill 0.6)
  Top 0.254: 74.27,58.47 v74.3,46.94 | v121.34,46.94 U3.59
  Top 0.305: J16.3 58.69,87.67 59.13,87.22 65.81,87.22 68,85.04 71.3,85.04 74.04,82.3 74.04,58.7 74.27,58.47
  Bottom 0.254: v74.3,46.94 v121.34,46.94
PWM3  (via drill 0.6)
  Top 0.305: J17.3 88.53,89.65 91.54,86.64 100.15,86.64 102.97,81.97 103,60.38 v102.97,59.18
  Bottom 0.305: v102.97,59.18 116.1,59.16 U3.60
PWM4
  Top 0.254: 112.62,76.02 112.62,64.59
  Top 0.305: J18.3 118.38,91.38 111.66,84.66 111.66,76.99 112.62,76.02 | 112.62,64.59 112.62,62.53 116.2,58.95 U3.61
PWM5  (via drill 0.6)
  Top 0.305: J19.3 147.59,87.26 149.73,84.2 v154.74,84.2 | v160.73,53.47 160.71,53.44 160.71,54.51 159.82,55.4 159.82,63.96 161.06,65.2 v161.06,84.2 | v108.56,53.24 108.56,56.49 U3.64
  Bottom 0.305: v160.73,53.47 108.74,53.42 v108.56,53.24 | v154.74,84.2 v161.06,84.2
RS485_CONTROL
  Bottom 0.305: U5.3 U5.2 165.67,31.25 164.92,29.59 71.58,29.62 70.46,31.8 70.46,33.63 U3.18
RS485_TX  (via drill 0.6)
  Top 0.305: v95.99,22.35 95.99,33.55 U3.28
  Bottom 0.305: U5.4 165.47,26.2 164.26,22.35 v95.99,22.35
SCL1  (via drill 0.6)
  Top 0.406: v136.5,43.94 U3.44 | 147.27,15.6 R3.P$2
  Top 0.813: J26.4 130.07,6.45 SCL.TP 130.07,13.92 131.04,15.6 140.41,15.6 142.88,12.72 145.85,12.72 147.25,14.12 R3.P$2 147.17,15.65 147.17,21.29 136.53,31.93 U3.44
  Bottom 0.406: v136.5,43.94 169.65,43.94 173.54,48.12 173.54,48.15 U2.6 176.62,48.15 180.09,51.61 180.09,55.3 181.74,56.95 181.74,59.61 182.4,60.27 184.54,60.27 J33.2
SDA1  (via drill 0.6)
  Top 0.305: v177.19,36.88 177.19,43.45 U2.5
  Top 0.406: v182.04,55.17 182.04,61.77 183.06,62.79 184.56,62.79 J33.3
  Top 0.61: J26.5 132.72,11.94 SDA.TP 132.77,13.31 133.17,14.25 139.34,14.25 141.68,11.23 147.5,11.23 149.81,13.54 149.81,15.55 R3.P$3 149.78,21.87 139.27,32.38 139.27,33.45 U3.45
  Bottom 0.305: U3.45 139.06,34.34 140.49,35.76 151.44,35.76 152.3,34.9 158.04,34.9 161.39,39.04 175.03,39.04 v177.19,36.88
  Bottom 0.406: U2.5 176.01,45.6 181.51,51.1 181.51,54.63 v182.04,55.17
SW1  (via drill 0.6)
  Top 0.254: v99.69,36.12 v99.67,13.64
  Top 0.406: R3.P$4 152.32,13.82 J5.2
  Bottom 0.406: U3.8 99.49,36.2 v99.69,36.12 | v99.67,13.64 101.3,14.66 139.52,14.66 141.15,13.11 151.66,13.11 152.32,14.86 R3.P$4
SW2  (via drill 0.6)
  Top 0.305: v154.86,38.81 R3.P$5
  Top 0.406: R3.P$5 154.87,8.76 J6.2
  Bottom 0.305: U3.7 154.79,38.73 v154.86,38.81
SW3  (via drill 0.6)
  Top 0.305: v157.33,41.5 157.33,15.65 R3.P$6
  Top 0.406: R3.P$6 157.41,11.76 160.4,8.76 J13.2
  Bottom 0.305: U3.6 157.1,41.27 v157.33,41.5
SW4  (via drill 0.6)
  Top 0.305: U3.57 126.36,47.73 v127.23,46.86 | v159.92,47.09 159.92,15.6 R3.P$7
  Top 0.406: R3.P$7 159.94,11.91 161.93,9.93 166.4,9.93 168.17,8.15 168.17,6.59 J14.2
  Bottom 0.305: v127.23,46.86 159.69,46.86 v159.92,47.09
SW5  (via drill 0.6)
  Top 0.254: U3.67 v100.97,50.55 | v161.42,50.55 161.44,19.3 161.44,17.73 162.51,16.66 162.51,15.6 R3.P$8 162.46,15.6 162.48,15.54
  Bottom 0.254: v100.97,50.55 v161.42,50.55
U1RX
  Top 0.406: JP4.2 U3.38
U1RX_IN  (via drill 0.6)
  Top 0.305: R3.P$9 164.97,15.67 163.02,17.91 163.02,46.15 v163.07,46.2 164.11,46.43 164.11,62.84 163.14,64.62 v163.14,71.7
  Bottom 0.305: v163.14,71.7 124.87,71.7 124.1,72.92 U6.13 | JP2.1 15.24,39.29 16.1,38.43 19.41,38.43 19.96,38.99 41.05,38.99 41.71,38.33 43.46,38.33 44.3,39.17 44.3,42.19 45.01,42.9 112.55,42.9 113.84,44.2 132.66,44.2 134.01,45.54 162.41,45.54 v163.07,46.2 163.19,46.15
U1TX  (via drill 0.6)
  Top 0.406: JP3.1 178.33,70.81 177.44,69.93 177.44,65.48 180.39,63.88 180.39,46.23 179.73,45.59 179.73,18.95 v179.45,18.67 | v123.37,18.82 123.37,33.2 U3.39
  Bottom 0.406: v179.45,18.67 123.52,18.67 v123.37,18.82
XBEE_RX
  Bottom 0.305: U3.34 111.12,37.13 111.86,37.87 152.91,37.92 153.57,37.26 157.1,37.24 160.38,40.92 179.12,40.92 180.87,37.01 183.78,37.01 J3.3
XBEE_TX  (via drill 0.6)
  Top 0.305: v113.74,36.8 113.72,33.71 U3.35
  Bottom 0.305: J3.2 180.57,34.52 178.05,39.98 160.68,39.98 157.35,35.97 153.19,35.92 152.43,36.8 v113.74,36.8

### Text on the board
tPlace: ROBOTNIK MD13S CONTROLLER REV 1.0
_tsilk: - | + | - | + | - | + | + | - | + | - | 1 | 2 | 2 | 3 | 4 | 5 | RED | RED | RED | RED | 12V DC IN | 5V | IN | 3.3V | MASTER | OUT | - | SLAVE | I2C | + | - | HOST | + | SLAVE | MASTER | - | XBEE | + | RX IN | OPTO IN | RS485 | B A G | GND | ANALOG IN | SERVO CONTROL | 1 | 2 | 3 | 4 | 5 | 1 | 2 | 3 | 4